# Altium schematic sheet ADC_DAC_6W.SchDoc: HV_Module
size 420 x 297 mm; EDA_Number: ARTIQ; Projet: HV_Module; Author: G.Kasprowicz; CompanyName: WUT ISE; DrawnBy: G.Kasprowicz; Organization: WUT ISE; Address1: PW ISE; Address2: Nowowiejska 15/19 00-665 Warsaw; Address3: gkasprow@gmail.com; DocumentNumber: 2; Revision: 1.0; SheetNumber: 2; SheetTotal: 6; ModifiedBy: -; CheckedDate: -; Title2: ADC_DAC; DivGrp: WUT ISE; Designer: G.Kasprowicz; ModifiedDate: -; ProjectName: Sensor Box
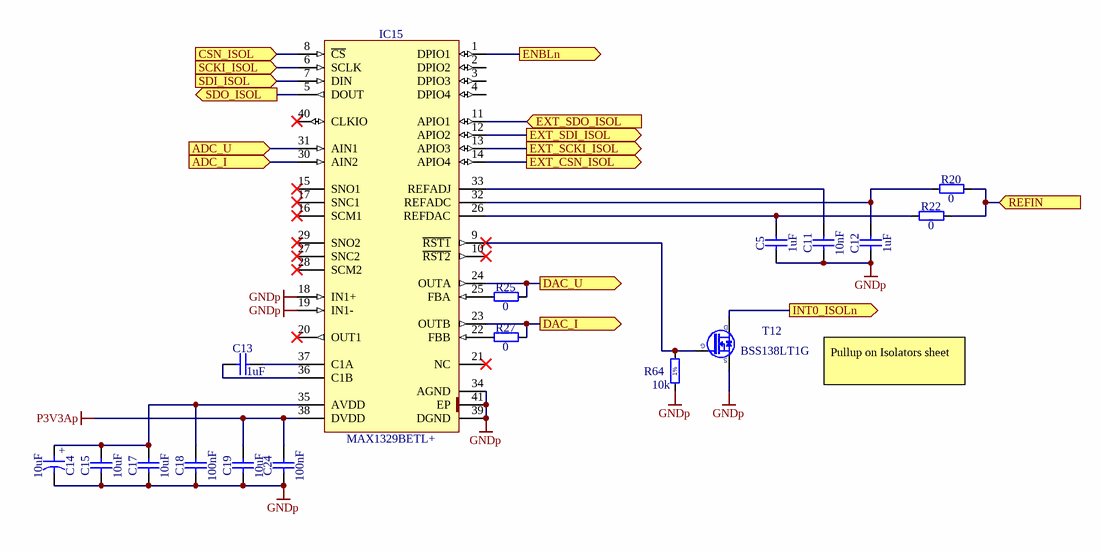
[diagram p0: ADC_DAC_6W.SchDoc]

## Parts
C5  1uF  [CAPC1005X55N]
C11  10nF  [CAPC1005X55N]
C12  1uF  [CAPC1005X55N]
C13  1uF  [CAPC1005X55N]
C14  10uF  [CAPMP3216X180N]
C15  10uF  [CAPC1608X80N]
C17  10uF  [CAPC1608X80N]
C18  100nF  [CAPC1005X55N]
C19  10uF  [CAPC1608X80N]
C24  100nF  [CAPC1005X55N]
IC15  MAX1329BETL+  [QFN50P600X600X80-41N-S425]
R20  0  [RESC1005X40N]
R22  0  [RESC1005X40N]
R25  0  [RESC1005X40N]
R27  0  [RESC1005X40N]
R64  10k  [RESC1005X40N]
T12  BSS138LT1G  [SOT95P240X110-3N]

## Ports
ADC_I (in), ADC_U (in), CSN_ISOL (in), DAC_I (out), DAC_U (out), ENBLn (out), EXT_CSN_ISOL (out), EXT_SCKI_ISOL (out), EXT_SDI_ISOL (out), EXT_SDO_ISOL (in), INT0_ISOLn (out), REFIN (in), SCKI_ISOL (in), SDI_ISOL (in), SDO_ISOL (out)

## Nets
GNDp: C5.1 C11.1 C12.1 C14.2 C15.1 C17.1 C18.1 C19.1 C24.1 IC15.18(IN1+) IC15.19(IN1-) IC15.34(AGND) IC15.39(DGND) IC15.41(EP) R64.1 T12.2(S)
P3V3Ap: C19.2 C24.2 IC15.38(DVDD)
ADC_I: IC15.30(AIN2) ; port ADC_I
ADC_U: IC15.31(AIN1) ; port ADC_U
CSN_ISOL: IC15.8(~{CS}) ; port CSN_ISOL
DAC_I: IC15.23(OUTB) R27.2 ; port DAC_I
DAC_U: IC15.24(OUTA) R25.2 ; port DAC_U
ENBLn: IC15.1(DPIO1) ; port ENBLn
EXT_CSN_ISOL: IC15.14(APIO4) ; port EXT_CSN_ISOL
EXT_SCKI_ISOL: IC15.13(APIO3) ; port EXT_SCKI_ISOL
EXT_SDI_ISOL: IC15.12(APIO2) ; port EXT_SDI_ISOL
EXT_SDO_ISOL: IC15.11(APIO1) ; port EXT_SDO_ISOL
INT0_ISOLn: T12.3(D) ; port INT0_ISOLn
REFIN: R20.2 R22.2 ; port REFIN
SCKI_ISOL: IC15.6(SCLK) ; port SCKI_ISOL
SDI_ISOL: IC15.7(DIN) ; port SDI_ISOL
SDO_ISOL: IC15.5(DOUT) ; port SDO_ISOL
NetC5_2: C5.2 IC15.26(REFDAC) R22.1
NetC11_2: C11.2 IC15.33(REFADJ)
NetC12_2: C12.2 IC15.32(REFADC) R20.1
NetC13_1: C13.1 IC15.36(C1B)
NetC13_2: C13.2 IC15.37(C1A)
NetC14_1: C14.1 C15.2 C17.2 C18.2 IC15.35(AVDD)
NetIC15_9: IC15.9(~{RST1}) R64.2 T12.1(G)
NetIC15_22: IC15.22(FBB) R27.1
NetIC15_25: IC15.25(FBA) R25.1

Not connected (* = marked no-connect by the designer): IC15 2(DPIO2) 3(DPIO3) 4(DPIO4) 10(~{RST2})* 15(SNO1)* 16(SCM1)* 17(SNC1)* 20(OUT1)* 21(NC)* 27(SNC2)* 28(SCM2)* 29(SNO2)* 40(CLKIO)*

## Notes on the sheet
- Pullup on Isolators sheet
- Project/Equipment
- Document
- Designer
- Drawn by
- Check.by
- Copyright WUT ISE 2020.
  This documentation describes Open Hardware and is licensed under the CERN OHL v.1.2. You may redistribute and modify this documentation under the terms of the CERN OHL v.1.2. (http://ohwr.org/CERNOHL). This documentation is distributed WITHOUT ANY EXPRESS OR IMPLIED WARRANTY, INCLUDING OF MERCHANTABILITY, SATISFACTORY QUALITY AND FITNESS FOR A PARTICULAR PURPOSE. Please see the CERN OHL v.1.2 for applicable conditions.
- Contact
- File
- Last Mod.
- Print Date
- Sheet
- Size
- A3
- of
- Rev
- (in symbol CTE3216-18_10UF_16V_20%_AVX_TCJ) +
- (in symbol R0402_10K_1%_0.0625W_100PPM) 1%

## Library data of the parts
C5 C12 C13 = CC0402_1UF_16V_10%_X5R: Non-polarised capacitor; Part Description: SMD Multilayer Chip Ceramic Capacitor; Manufacturer: GENERIC; Manufacturer1 Part Number: C1005X5R1C105KT; Voltage: 16V; TC: X5R; Tolerance: ±10%; Part Number: CC0402_1UF_16V_10%_X5R; Component Kind: Standard; Component Type: Standard; Pin Count: 2; Value: 1uF; Status: Preferred; Manufacturer Part Number: CC0402_1UF_16V_10%_X5R; Case: 0402; Mounted: Yes; Socket: No; SMD: Yes; Sense: No; Manufacturer1 Example: TDK; Manufacturer1 ComponentHeight: 0.55mm; HelpURL: \\cern.ch\dfs\Applications\Altium\Datasheets\CC0402_X5R_TDK_C.pdf; Author: CERN DEM JLC; CreateDate: 2012-10-25; LatestRevisionDate: 2012-10-25
C11 = CC0402_10NF_25V_10%_X7R: Non-polarised capacitor; Part Description: SMD Multilayer Chip Ceramic Capacitor; Manufacturer: GENERIC; Manufacturer1 Part Number: C1005X7R1E103K050; Voltage: 25V; TC: X7R; Tolerance: ±10%; Part Number: CC0402_10NF_25V_10%_X7R; Component Kind: Standard; Component Type: Standard; Pin Count: 2; Value: 10nF; Status: Preferred; Manufacturer Part Number: CC0402_10NF_25V_10%_X7R; Case: 0402; Mounted: Yes; Socket: No; SMD: Yes; Sense: No; Manufacturer1 Example: TDK; Manufacturer1 ComponentHeight: 0.55mm; HelpURL: \\cern.ch\dfs\Applications\Altium\Datasheets\CC0402_X7R_TDK_C.pdf; Author: CERN DEM JLC; CreateDate: 25.10.2012; LatestRevisionDate: 25.10.2012
C14 = CTE3216-18_10UF_16V_20%_AVX_TCJ: Polarised capacitor; Part Description: ESR 0R200 Tantalum Solid Electrolytic Chip Capacitor with Conductive Polymer Electrode; Manufacturer: AVX; Manufacturer Part Number: TCJA106M016R0200; Voltage: 16V; Tolerance: ±20%; Part Number: CTE3216-18_10UF_16V_20%_AVX_TCJ; Component Kind: Standard; Component Type: Standard; Pin Count: 2; Value: 10uF; Status: Preferred; Case: A; Mounted: Yes; Socket: No; SMD: Yes; Sense: No; ComponentHeight: 1.8mm; HelpURL: \\cern.ch\dfs\Applications\Altium\Datasheets\CTE_AVX_TCJ.pdf; Author: CERN DEM JLC; CreateDate: 29.03.2012; LatestRevisionDate: 29.03.2012
C15 C17 C19 = CC0603_10UF_16V_20%_X5R: Non-polarised capacitor; Part Description: SMD Multilayer Chip Ceramic Capacitor; Manufacturer: GENERIC; Manufacturer1 Part Number: GRM188R61C106MA73D; Voltage: 16V; TC: X5R; Tolerance: ±20%; Part Number: CC0603_10UF_16V_20%_X5R; Component Kind: Standard; Component Type: Standard; Pin Count: 2; Value: 10uF; Status: None; Manufacturer Part Number: CC0603_10UF_16V_20%_X5R; Case: 0603; Mounted: Yes; Socket: No; SMD: Yes; Sense: No; Manufacturer1 Example: MURATA; Manufacturer1 ComponentHeight: 0.8mm; HelpURL: \\cern.ch\dfs\Applications\Altium\Datasheets\CC0603_X5R_MURATA_GRM.pdf; Author: CERN DEM MR; CreateDate: 02.03.2016; LatestRevisionDate: 02.03.2016
C18 C24 = CC0402_100NF_16V_10%_X5R: Non-polarised capacitor; Part Description: SMD Multilayer Chip Ceramic Capacitor; Manufacturer: GENERIC; Manufacturer1 Part Number: GRM155R61C104KA88D; Voltage: 16V; TC: X5R; Tolerance: ±10%; Part Number: CC0402_100NF_16V_10%_X5R; Component Kind: Standard; Component Type: Standard; Pin Count: 2; Value: 100nF; Status: None; Manufacturer Part Number: CC0402_100NF_16V_10%_X5R; Case: 0402; Mounted: Yes; Socket: No; SMD: Yes; Sense: No; Manufacturer1 Example: MURATA; Manufacturer1 ComponentHeight: 0.55mm; HelpURL: \\cern.ch\dfs\Applications\Altium\Datasheets\CC0402_X5R_MURATA_GRM.pdf; Author: CERN DEM JLC; CreateDate: 10.12.2013; LatestRevisionDate: 10.12.2013
IC15 = MAX1329BETL+: 12-/16-Bit DAS with ADC, DACs, DPIOs, APIOs, Reference, Voltage Monitors, and Temp Sensor; Manufacturer: MAXIM; PressFit: No; Bonding: No; Part Number: MAX1329BETL+; Component Kind: Standard; Component Type: Standard; Device: MAX1329BETL+; PackageDescription: QFN, 0.50mm Pitch, Square; 40 Pin, 6.00mm L X 6.00mm W X 0.80mm H body (w/Thermal Tab 4.25 X 4.25mm), IPC Medium Density; Part Description: 12-/16-Bit DAS with ADC, DACs, DPIOs, APIOs, Reference, Voltage Monitors, and Temp Sensor; Manufacturer Part Number: MAX1329BETL+; Pin Count: 41; Case: QFN40; Mounted: Yes; Socket: No; SMD: Yes; Sense: No; ComponentHeight: 0.8mm; Author: CERN DEM HF; HelpURL: \\cern.ch\dfs\Applications\Altium\Datasheets\MAX1329BETL+.pdf; CreateDate: 09.02.2022; LatestRevisionDate: 09.02.2022
R20 R22 R25 R27 = R0402_0R_JUMPER: Resistor; Part Description: 1A (0.05R Max DC Resistance) Zero Ohm Jumper; Manufacturer: GENERIC; Manufacturer1 Part Number: 232270591001L; PressFit: No; Part Number: R0402_0R_JUMPER; Component Kind: Standard; Component Type: Standard; Pin Count: 2; Value: 0; Status: Not Recommended; Manufacturer Part Number: R0402_0R_JUMPER; Case: 0402; Mounted: Yes; Sense: No; Socket: No; SMD: Yes; Manufacturer1 Example: YAGEO PHYCOMP; Manufacturer1 ComponentHeight: 0.4mm; HelpURL: \\cern.ch\dfs\Applications\Altium\Datasheets\R0402_Phycomp_RC0402.pdf; Author: CERN DEM JLC; CreateDate: 03.12.2007; LatestRevisionDate: 17.10.2012
R64 = R0402_10K_1%_0.0625W_100PPM: Resistor - 1%; Part Description: General Purpose Thick Film Chip Resistor; Manufacturer: GENERIC; Manufacturer1 Part Number: 232270671003L; TC: ±100ppm/°C; Part Number: R0402_10K_1%_0.0625W_100PPM; Component Kind: Standard; Component Type: Standard; Pin Count: 2; Value: 10k; Status: Not recommended; Power: 0.0625W; Tolerance: ±1%; Manufacturer Part Number: R0402_10K_1%_0.0625W_100PPM; Case: 0402; Mounted: Yes; Sense: No; Socket: No; SMD: Yes; Manufacturer1 Example: YAGEO PHYCOMP; Manufacturer1 ComponentHeight: 0.4mm; HelpURL: \\cern.ch\dfs\Applications\Altium\Datasheets\R0402_Phycomp_RC0402.pdf; Author: CERN DEM JLC; CreateDate: 2007-12-03; LatestRevisionDate: 2012-10-17
T12 = BSS138LT1G: N-CHANNEL MOSFET WITH DIODE; Part Description: 50V 200mA N-Channel Enhancement Mode Field-Effect Transistor; Manufacturer: ON SEMICONDUCTOR; PressFit: No; Bonding: No; Part Number: BSS138LT1G; Component Kind: Standard; Component Type: Standard; Device: BSS138LT1G; PackageDescription: SOT23 3-Leads, Pitch 0.95mm - Body 1.4x3mm, IPC Medium Density; Manufacturer Part Number: BSS138LT1G; Pin Count: 3; Case: SOT23-3; Mounted: Yes; Socket: No; SMD: Yes; Sense: No; ComponentHeight: 1.11mm; HelpURL: \\cern.ch\dfs\Applications\Altium\Datasheets\BSS138LT1G.pdf; Author: CERN DEM JLC; CreateDate: 23.03.2009; LatestRevisionDate: 23.03.2009